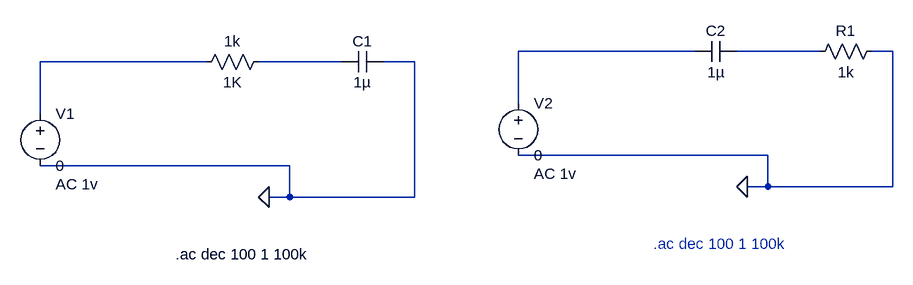
[diagram p0: schematic filters.asc]
filters.asc, the LTspice schematic file:
Version 4
SHEET 1 880 680
WIRE 560 96 288 96
WIRE 752 96 624 96
WIRE 864 96 832 96
WIRE -192 112 -448 112
WIRE 16 112 -112 112
WIRE 128 112 80 112
WIRE 288 176 288 96
WIRE -448 192 -448 112
WIRE 672 256 288 256
WIRE -64 272 -448 272
WIRE 672 304 672 256
WIRE 672 304 640 304
WIRE 864 304 864 96
WIRE 864 304 672 304
WIRE -64 320 -64 272
WIRE -64 320 -96 320
WIRE 128 320 128 112
WIRE 128 320 -64 320
FLAG -96 320 0
FLAG 640 304 0
SYMBOL res -96 96 R90
WINDOW 0 0 56 VBottom 2
WINDOW 3 32 56 VTop 2
SYMATTR InstName 1k
SYMATTR Value 1K
SYMATTR SpiceLine tol=1 pwr=0.1
SYMBOL cap 80 96 R90
WINDOW 0 0 32 VBottom 2
WINDOW 3 32 32 VTop 2
SYMATTR InstName C1
SYMATTR Value 1µ
SYMBOL voltage -448 176 R0
WINDOW 123 24 124 Left 2
WINDOW 39 0 0 Left 0
SYMATTR Value2 AC 1v
SYMATTR InstName V1
SYMATTR Value 0
SYMBOL voltage 288 160 R0
WINDOW 123 24 124 Left 2
WINDOW 39 0 0 Left 0
SYMATTR Value2 AC 1v
SYMATTR InstName V2
SYMATTR Value 0
SYMBOL res 848 80 R90
WINDOW 0 0 56 VBottom 2
WINDOW 3 32 56 VTop 2
SYMATTR InstName R1
SYMATTR Value 1k
SYMBOL cap 624 80 R90
WINDOW 0 0 32 VBottom 2
WINDOW 3 32 32 VTop 2
SYMATTR InstName C2
SYMATTR Value 1µ
TEXT -240 408 Left 2 !.ac dec 100 1 100k
TEXT 496 392 Left 2 ;.ac dec 100 1 100k

The netlist it stands for:
* filters.asc
R§1k N004 N003 1K tol=1 pwr=0.1
C1 0 N004 1µ
V1 N003 0 0 AC 1v
V2 N001 0 0 AC 1v
R1 0 N002 1k
C2 N002 N001 1µ
.ac dec 100 1 100k
* .ac dec 100 1 100k
.backanno
.end